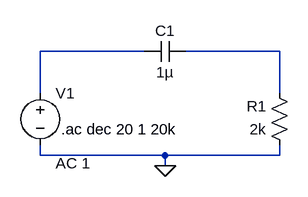
[diagram p0: schematic Simple design.asc]
Simple design.asc, the LTspice schematic file:
Version 4
SHEET 1 880 680
WIRE 240 48 80 48
WIRE 448 48 304 48
WIRE 80 112 80 48
WIRE 448 112 448 48
WIRE 80 208 80 192
WIRE 272 208 80 208
WIRE 448 208 448 192
WIRE 448 208 272 208
WIRE 272 224 272 208
FLAG 272 224 0
SYMBOL voltage 80 96 R0
WINDOW 123 24 124 Left 2
WINDOW 39 0 0 Left 0
SYMATTR Value2 AC 1
SYMATTR InstName V1
SYMATTR Value ""
SYMBOL res 464 208 R180
WINDOW 0 36 76 Left 2
WINDOW 3 36 40 Left 2
SYMATTR InstName R1
SYMATTR Value 2k
SYMBOL cap 304 32 R90
WINDOW 0 0 32 VBottom 2
WINDOW 3 32 32 VTop 2
SYMATTR InstName C1
SYMATTR Value 1µ
TEXT 112 168 Left 2 !.ac dec 20 1 20k

The netlist it stands for:
* Simple design.asc
V1 N001 0 AC 1
R1 0 N002 2k
C1 N002 N001 1µ
.ac dec 20 1 20k
.backanno
.end